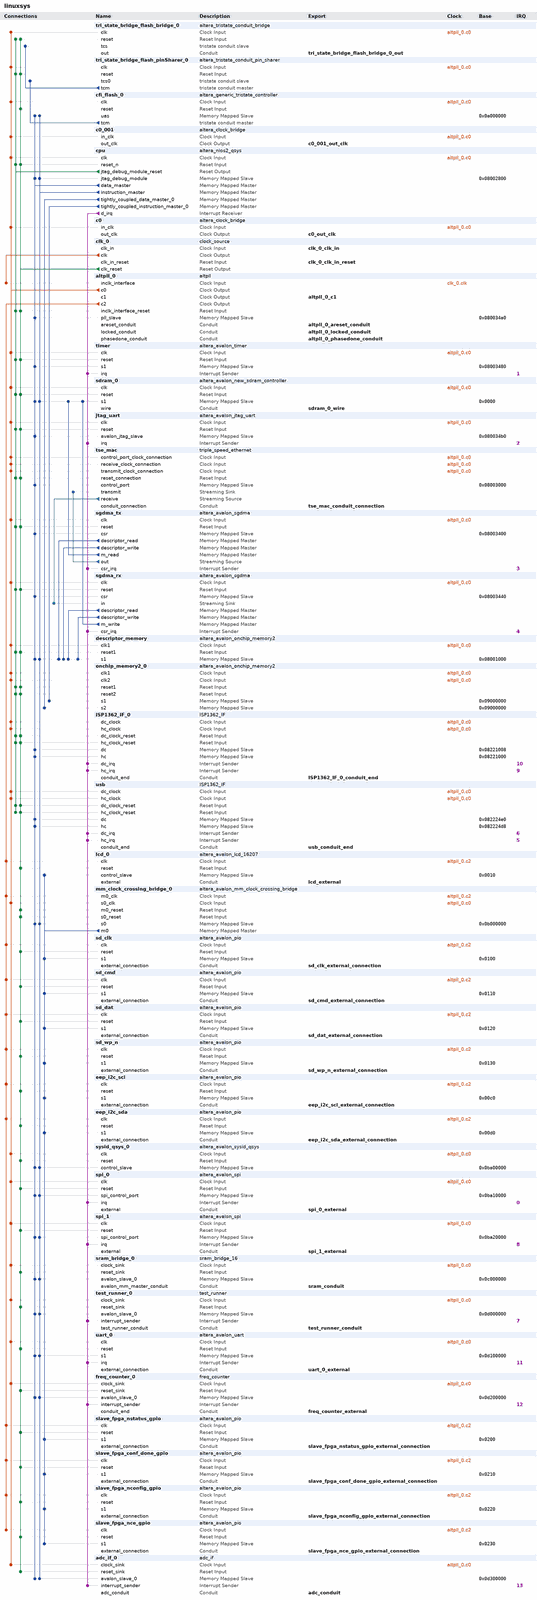
[diagram p0: system contents, whole]
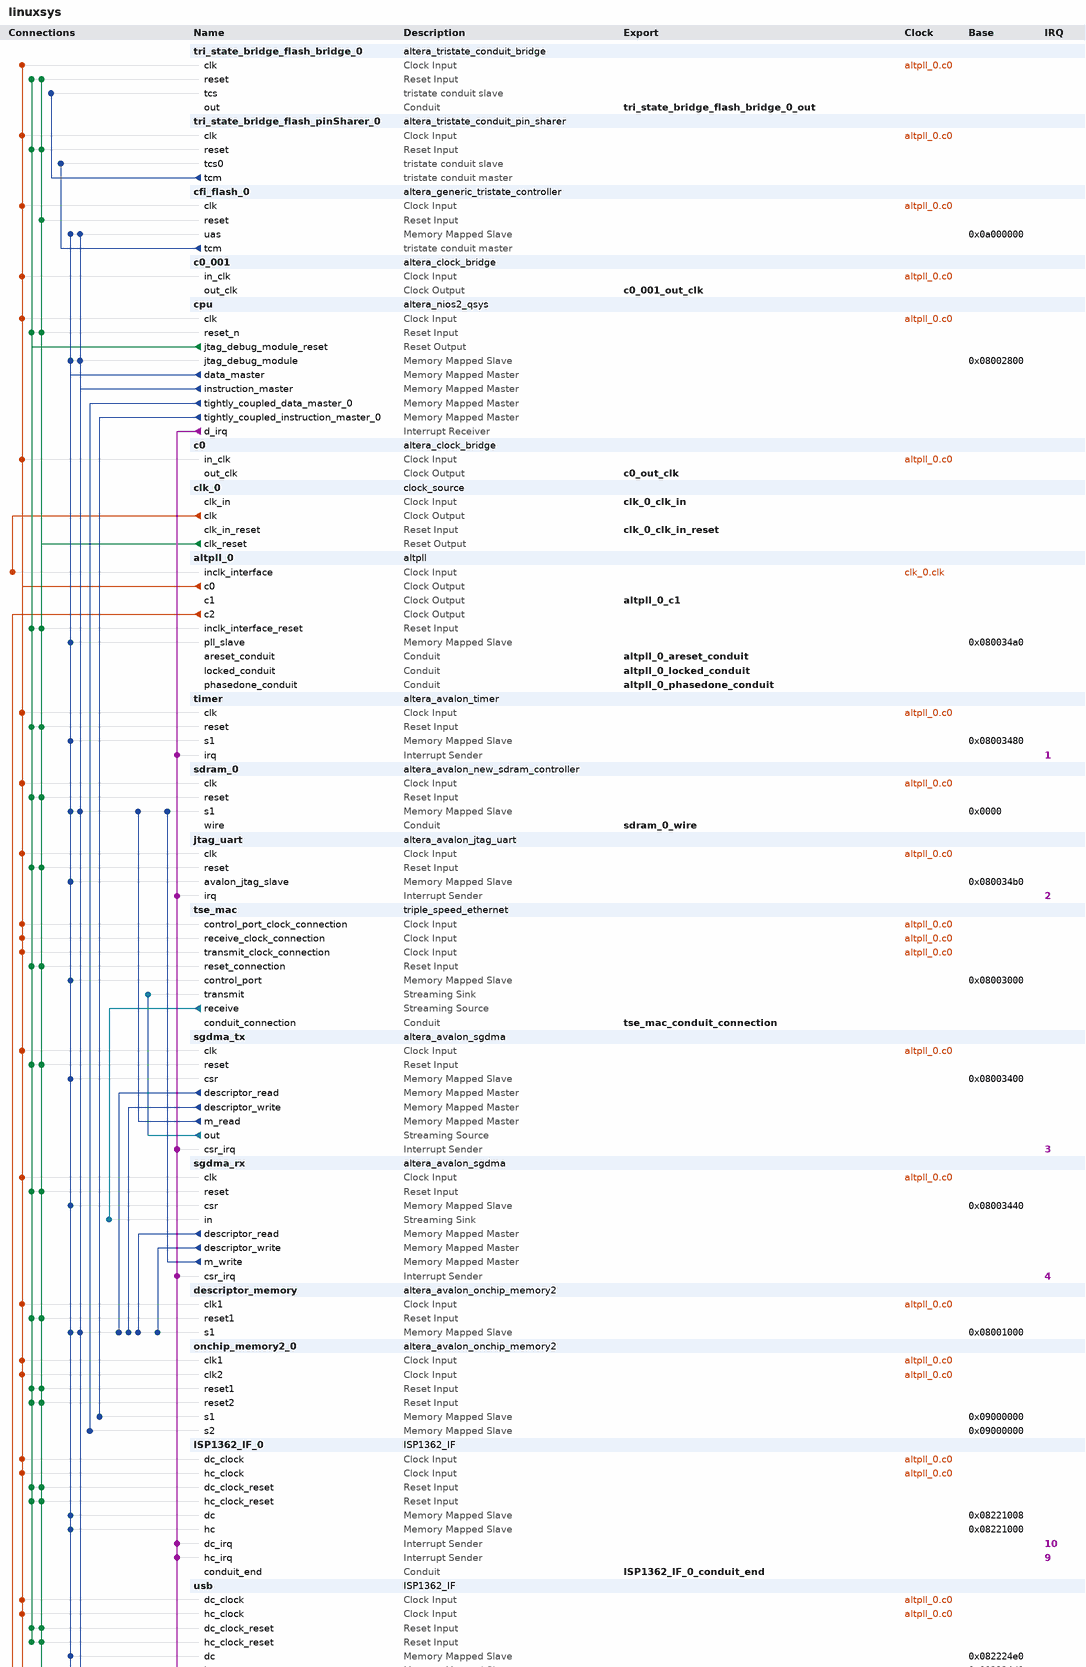
[diagram p1: system contents, upper part]
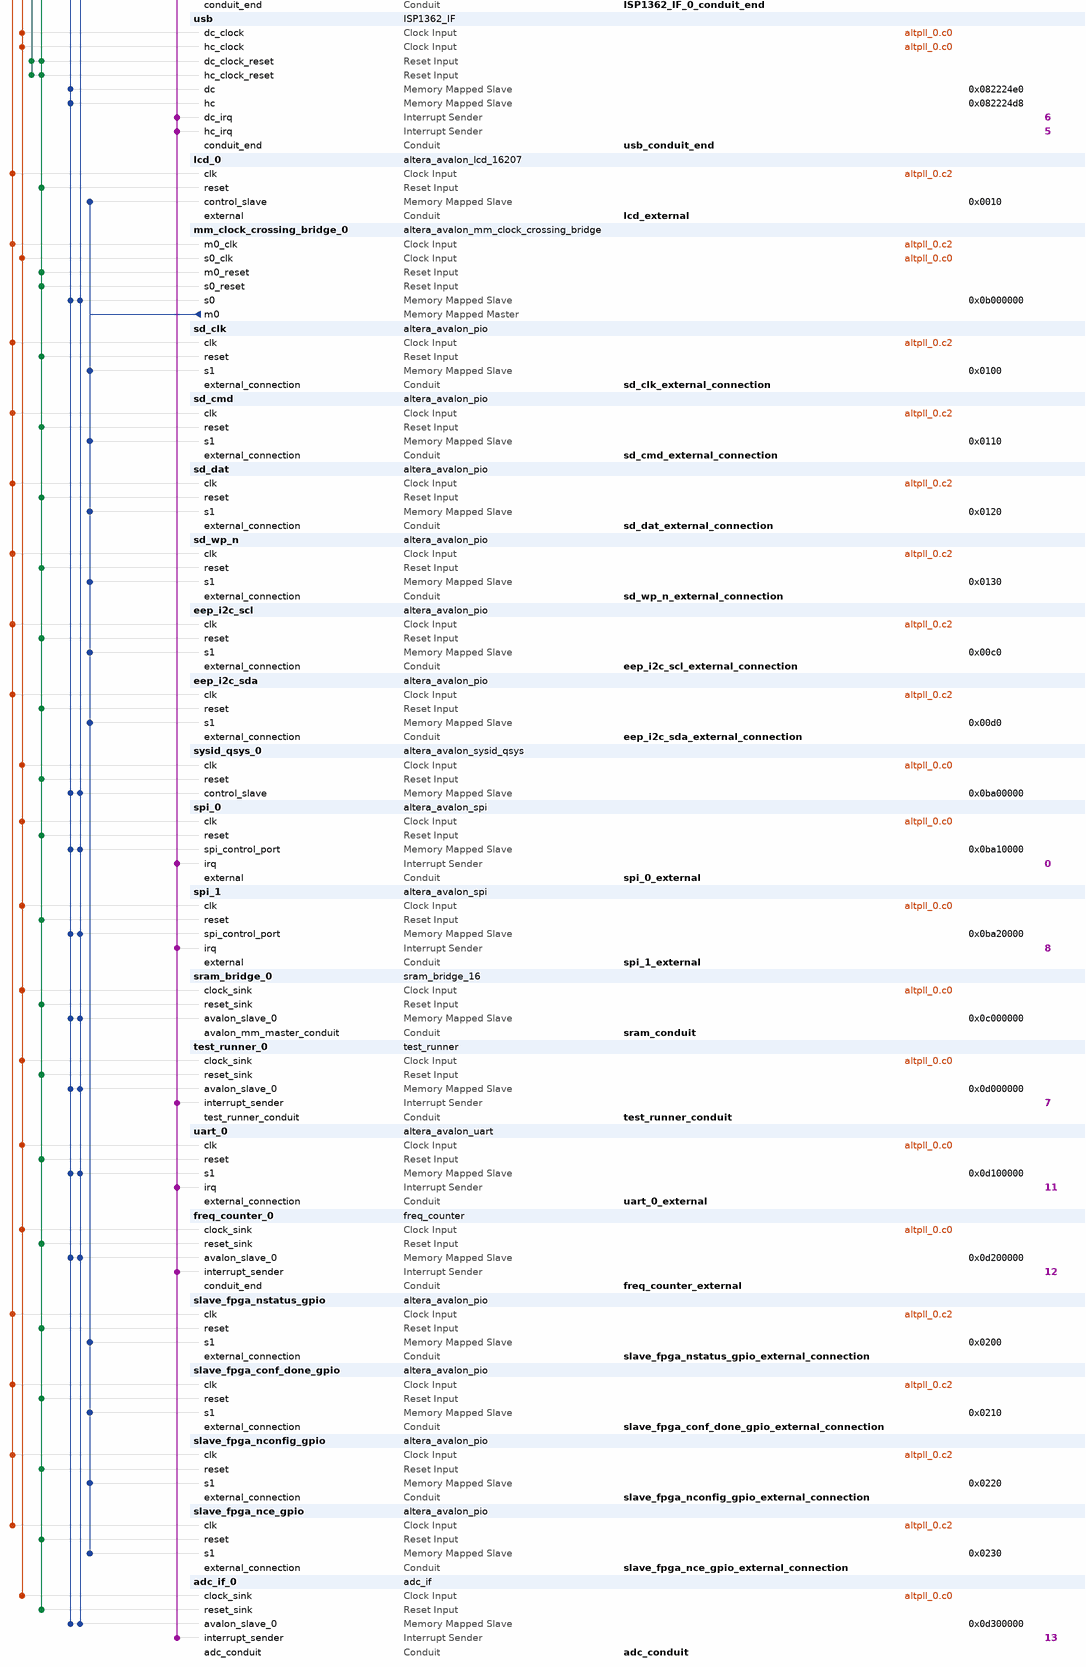
[diagram p2: system contents, lower part]
# Platform Designer (Qsys) system linuxsys, CYCLONEIVE auto
# Parameters at their usual value, and those the tool derives, are not listed.
package require -exact qsys 11.1
create_system linuxsys
set_project_property DEVICE_FAMILY CYCLONEIVE
set_project_property DEVICE auto

add_instance tri_state_bridge_flash_bridge_0 altera_tristate_conduit_bridge 11.1

add_instance tri_state_bridge_flash_pinSharer_0 altera_tristate_conduit_pin_sharer 11.1
set_instance_parameter_value tri_state_bridge_flash_pinSharer_0 NUM_INTERFACES 1
set_instance_parameter_value tri_state_bridge_flash_pinSharer_0 MODULE_ORIGIN_LIST cfi_flash_0.tcm,cfi_flash_0.tcm,cfi_flash_0.tcm,cfi_flash_0.tcm,cfi_flash_0.tcm
set_instance_parameter_value tri_state_bridge_flash_pinSharer_0 SHARED_SIGNAL_LIST address_to_the_cfi_flash_0,read_n_to_the_cfi_flash_0,write_n_to_the_cfi_flash_0,data_to_and_from_the_cfi_flash_0,select_n_to_the_cfi_flash_0

add_instance cfi_flash_0 altera_generic_tristate_controller 11.1
set_instance_parameter_value cfi_flash_0 TCM_ADDRESS_W 23
set_instance_parameter_value cfi_flash_0 TCM_DATA_W 8
set_instance_parameter_value cfi_flash_0 TCM_BYTEENABLE_W 1
set_instance_parameter_value cfi_flash_0 TCM_READ_WAIT 160
set_instance_parameter_value cfi_flash_0 TCM_WRITE_WAIT 160
set_instance_parameter_value cfi_flash_0 TCM_SETUP_WAIT 60
set_instance_parameter_value cfi_flash_0 TCM_DATA_HOLD 60
set_instance_parameter_value cfi_flash_0 TCM_MAX_PENDING_READ_TRANSACTIONS 3
set_instance_parameter_value cfi_flash_0 TCM_TURNAROUND_TIME 2
set_instance_parameter_value cfi_flash_0 TCM_TIMING_UNITS 0
set_instance_parameter_value cfi_flash_0 TCM_READLATENCY 2
set_instance_parameter_value cfi_flash_0 TCM_SYMBOLS_PER_WORD 1
set_instance_parameter_value cfi_flash_0 USE_READ 1
set_instance_parameter_value cfi_flash_0 USE_BEGINTRANSFER 0
set_instance_parameter_value cfi_flash_0 USE_BYTEENABLE 0
set_instance_parameter_value cfi_flash_0 USE_OUTPUTENABLE 0
set_instance_parameter_value cfi_flash_0 ACTIVE_LOW_READ 1
set_instance_parameter_value cfi_flash_0 ACTIVE_LOW_BYTEENABLE 0
set_instance_parameter_value cfi_flash_0 ACTIVE_LOW_OUTPUTENABLE 0
set_instance_parameter_value cfi_flash_0 ACTIVE_LOW_BEGINTRANSFER 0
set_instance_parameter_value cfi_flash_0 CHIPSELECT_THROUGH_READLATENCY 0
set_instance_parameter_value cfi_flash_0 MODULE_ASSIGNMENT_KEYS embeddedsw.configuration.hwClassnameDriverSupportList,embeddedsw.configuration.hwClassnameDriverSupportDefault,embeddedsw.CMacro.SETUP_VALUE,embeddedsw.CMacro.WAIT_VALUE,embeddedsw.CMacro.HOLD_VALUE,embeddedsw.CMacro.TIMING_UNITS,embeddedsw.CMacro.SIZE,embeddedsw.memoryInfo.MEM_INIT_DATA_WIDTH,embeddedsw.memoryInfo.HAS_BYTE_LANE,embeddedsw.memoryInfo.IS_FLASH,embeddedsw.memoryInfo.GENERATE_DAT_SYM,embeddedsw.memoryInfo.GENERATE_FLASH,embeddedsw.memoryInfo.DAT_SYM_INSTALL_DIR,embeddedsw.memoryInfo.FLASH_INSTALL_DIR
set_instance_parameter_value cfi_flash_0 MODULE_ASSIGNMENT_VALUES {altera_avalon_lan91c111:altera_avalon_cfi_flash,altera_avalon_cfi_flash,60,160,60,"ns",8388608u,8,0,1,1,1,SIM_DIR,APP_DIR}
set_instance_parameter_value cfi_flash_0 INTERFACE_ASSIGNMENT_KEYS embeddedsw.configuration.isFlash,embeddedsw.configuration.isMemoryDevice,embeddedsw.configuration.isNonVolatileStorage
set_instance_parameter_value cfi_flash_0 INTERFACE_ASSIGNMENT_VALUES 1,1,1

add_instance c0_001 altera_clock_bridge 11.1
set_instance_parameter_value c0_001 DERIVED_CLOCK_RATE 100000000
set_instance_parameter_value c0_001 EXPLICIT_CLOCK_RATE 0

add_instance cpu altera_nios2_qsys 11.1
set_instance_parameter_value cpu muldiv_divider true
set_instance_parameter_value cpu mmu_enabled true
set_instance_parameter_value cpu resetSlave cfi_flash_0.uas
set_instance_parameter_value cpu mmu_TLBMissExcSlave onchip_memory2_0.s1
set_instance_parameter_value cpu exceptionSlave sdram_0.s1
set_instance_parameter_value cpu breakSlave cpu.jtag_debug_module
set_instance_parameter_value cpu mmu_processIDNumBits 10
set_instance_parameter_value cpu impl Fast
set_instance_parameter_value cpu icache_size 65536
set_instance_parameter_value cpu icache_numTCIM 1
set_instance_parameter_value cpu dcache_size 32768
set_instance_parameter_value cpu dcache_numTCDM 1

add_instance c0 altera_clock_bridge 11.1
set_instance_parameter_value c0 DERIVED_CLOCK_RATE 100000000
set_instance_parameter_value c0 EXPLICIT_CLOCK_RATE 0

add_instance clk_0 clock_source 11.1
set_instance_parameter_value clk_0 clockFrequency 50000000

add_instance altpll_0 altpll 11.1
set_instance_parameter_value altpll_0 INCLK0_INPUT_FREQUENCY 20000
set_instance_parameter_value altpll_0 CLK0_MULTIPLY_BY 2
set_instance_parameter_value altpll_0 CLK1_MULTIPLY_BY 2
set_instance_parameter_value altpll_0 CLK2_MULTIPLY_BY 1
set_instance_parameter_value altpll_0 CLK0_DIVIDE_BY 1
set_instance_parameter_value altpll_0 CLK1_DIVIDE_BY 1
set_instance_parameter_value altpll_0 CLK2_DIVIDE_BY 5
set_instance_parameter_value altpll_0 CLK1_PHASE_SHIFT -1806
set_instance_parameter_value altpll_0 CLK2_PHASE_SHIFT 0
set_instance_parameter_value altpll_0 CLK1_DUTY_CYCLE 50
set_instance_parameter_value altpll_0 CLK2_DUTY_CYCLE 50
set_instance_parameter_value altpll_0 PORT_clk1 PORT_USED
set_instance_parameter_value altpll_0 PORT_clk2 PORT_USED
set_instance_parameter_value altpll_0 PORT_clk3 PORT_UNUSED
set_instance_parameter_value altpll_0 PORT_ARESET PORT_USED
set_instance_parameter_value altpll_0 PORT_LOCKED PORT_UNUSED

add_instance timer altera_avalon_timer 11.1
set_instance_parameter_value timer period 1
set_instance_parameter_value timer periodUnits MSEC
set_instance_parameter_value timer timerPreset CUSTOM

add_instance sdram_0 altera_avalon_new_sdram_controller 11.1
set_instance_parameter_value sdram_0 TAC 5.5
set_instance_parameter_value sdram_0 TRCD 20.0
set_instance_parameter_value sdram_0 TRP 20.0
set_instance_parameter_value sdram_0 casLatency 3
set_instance_parameter_value sdram_0 columnWidth 10
set_instance_parameter_value sdram_0 dataWidth 32
set_instance_parameter_value sdram_0 generateSimulationModel false
set_instance_parameter_value sdram_0 model custom
set_instance_parameter_value sdram_0 numberOfBanks 4
set_instance_parameter_value sdram_0 numberOfChipSelects 1
set_instance_parameter_value sdram_0 powerUpDelay 100.0
set_instance_parameter_value sdram_0 refreshPeriod 15.625
set_instance_parameter_value sdram_0 rowWidth 13

add_instance jtag_uart altera_avalon_jtag_uart 11.1
set_instance_parameter_value jtag_uart simInteractiveOptions INTERACTIVE_ASCII_OUTPUT

add_instance tse_mac triple_speed_ethernet 11.1
set_instance_parameter_value tse_mac atlanticSinkClockRate 0
set_instance_parameter_value tse_mac atlanticSinkClockSource unassigned
set_instance_parameter_value tse_mac atlanticSourceClockRate 0
set_instance_parameter_value tse_mac atlanticSourceClockSource unassigned
set_instance_parameter_value tse_mac avalonSlaveClockRate 0
set_instance_parameter_value tse_mac avalonSlaveClockSource unassigned
set_instance_parameter_value tse_mac avalonStNeighbours {unassigned=unassigned}
set_instance_parameter_value tse_mac channel_count 1
set_instance_parameter_value tse_mac core_variation MAC_ONLY
set_instance_parameter_value tse_mac core_version 2817
set_instance_parameter_value tse_mac crc32check16bit 0
set_instance_parameter_value tse_mac crc32dwidth 8
set_instance_parameter_value tse_mac crc32gendelay 6
set_instance_parameter_value tse_mac crc32s1l2_extern false
set_instance_parameter_value tse_mac cust_version 0
set_instance_parameter_value tse_mac dataBitsPerSymbol 8
set_instance_parameter_value tse_mac dev_version 2817
set_instance_parameter_value tse_mac eg_addr 12
set_instance_parameter_value tse_mac ena_hash false
set_instance_parameter_value tse_mac enable_alt_reconfig false
set_instance_parameter_value tse_mac enable_clk_sharing false
set_instance_parameter_value tse_mac enable_ena 32
set_instance_parameter_value tse_mac enable_fifoless false
set_instance_parameter_value tse_mac enable_gmii_loopback true
set_instance_parameter_value tse_mac enable_hd_logic false
set_instance_parameter_value tse_mac enable_mac_flow_ctrl true
set_instance_parameter_value tse_mac enable_mac_txaddr_set true
set_instance_parameter_value tse_mac enable_mac_vlan false
set_instance_parameter_value tse_mac enable_maclite false
set_instance_parameter_value tse_mac enable_magic_detect false
set_instance_parameter_value tse_mac enable_multi_channel false
set_instance_parameter_value tse_mac enable_pkt_class true
set_instance_parameter_value tse_mac enable_pma false
set_instance_parameter_value tse_mac enable_reg_sharing false
set_instance_parameter_value tse_mac enable_sgmii false
set_instance_parameter_value tse_mac enable_shift16 true
set_instance_parameter_value tse_mac enable_sup_addr false
set_instance_parameter_value tse_mac enable_use_internal_fifo true
set_instance_parameter_value tse_mac export_calblkclk false
set_instance_parameter_value tse_mac export_pwrdn false
set_instance_parameter_value tse_mac ext_stat_cnt_ena false
set_instance_parameter_value tse_mac gigeAdvanceMode true
set_instance_parameter_value tse_mac ifGMII RGMII
set_instance_parameter_value tse_mac ifPCSuseEmbeddedSerdes false
set_instance_parameter_value tse_mac ing_addr 12
set_instance_parameter_value tse_mac insert_ta true
set_instance_parameter_value tse_mac maclite_gige false
set_instance_parameter_value tse_mac max_channels 1
set_instance_parameter_value tse_mac mdio_clk_div 40
set_instance_parameter_value tse_mac phy_identifier 0
set_instance_parameter_value tse_mac ramType AUTO
set_instance_parameter_value tse_mac reset_level 1
set_instance_parameter_value tse_mac starting_channel_number 0
set_instance_parameter_value tse_mac stat_cnt_ena false
set_instance_parameter_value tse_mac timingAdapterName timingAdapter
set_instance_parameter_value tse_mac toolContext SOPC_BUILDER
set_instance_parameter_value tse_mac transceiver_type GXB
set_instance_parameter_value tse_mac uiHostClockFrequency 0
set_instance_parameter_value tse_mac uiMDIOFreq {0.0 MHz}
set_instance_parameter_value tse_mac useLvds false
set_instance_parameter_value tse_mac useMAC true
set_instance_parameter_value tse_mac useMDIO true
set_instance_parameter_value tse_mac usePCS false
set_instance_parameter_value tse_mac use_sync_reset true

add_instance sgdma_tx altera_avalon_sgdma 11.1
set_instance_parameter_value sgdma_tx enableBurstTransfers false
set_instance_parameter_value sgdma_tx enableUnalignedTransfers false
set_instance_parameter_value sgdma_tx readBlockDataWidth 32
set_instance_parameter_value sgdma_tx sinkErrorWidth 0
set_instance_parameter_value sgdma_tx sourceErrorWidth 1
set_instance_parameter_value sgdma_tx transferMode MEMORY_TO_STREAM
set_instance_parameter_value sgdma_tx writeBurstcountWidth 4

add_instance sgdma_rx altera_avalon_sgdma 11.1
set_instance_parameter_value sgdma_rx enableBurstTransfers false
set_instance_parameter_value sgdma_rx enableUnalignedTransfers false
set_instance_parameter_value sgdma_rx readBlockDataWidth 32
set_instance_parameter_value sgdma_rx sinkErrorWidth 6
set_instance_parameter_value sgdma_rx sourceErrorWidth 0
set_instance_parameter_value sgdma_rx transferMode STREAM_TO_MEMORY
set_instance_parameter_value sgdma_rx writeBurstcountWidth 4

add_instance descriptor_memory altera_avalon_onchip_memory2 11.1
set_instance_parameter_value descriptor_memory dataWidth 32
set_instance_parameter_value descriptor_memory dualPort false
set_instance_parameter_value descriptor_memory initMemContent true
set_instance_parameter_value descriptor_memory initializationFileName descriptor_memory
set_instance_parameter_value descriptor_memory memorySize 4096

add_instance onchip_memory2_0 altera_avalon_onchip_memory2 11.1
set_instance_parameter_value onchip_memory2_0 dataWidth 32
set_instance_parameter_value onchip_memory2_0 dualPort true
set_instance_parameter_value onchip_memory2_0 initMemContent true
set_instance_parameter_value onchip_memory2_0 initializationFileName onchip_memory2_0
set_instance_parameter_value onchip_memory2_0 memorySize 512

add_instance ISP1362_IF_0 ISP1362_IF 1.0

add_instance usb ISP1362_IF 1.0

add_instance lcd_0 altera_avalon_lcd_16207 11.1

add_instance mm_clock_crossing_bridge_0 altera_avalon_mm_clock_crossing_bridge 11.1
set_instance_parameter_value mm_clock_crossing_bridge_0 DATA_WIDTH 32
set_instance_parameter_value mm_clock_crossing_bridge_0 ADDRESS_WIDTH 10
set_instance_parameter_value mm_clock_crossing_bridge_0 MAX_BURST_SIZE 1
set_instance_parameter_value mm_clock_crossing_bridge_0 COMMAND_FIFO_DEPTH 32
set_instance_parameter_value mm_clock_crossing_bridge_0 RESPONSE_FIFO_DEPTH 256
set_instance_parameter_value mm_clock_crossing_bridge_0 MASTER_SYNC_DEPTH 3
set_instance_parameter_value mm_clock_crossing_bridge_0 SLAVE_SYNC_DEPTH 3

add_instance sd_clk altera_avalon_pio 11.1
set_instance_parameter_value sd_clk direction Output
set_instance_parameter_value sd_clk width 1

add_instance sd_cmd altera_avalon_pio 11.1
set_instance_parameter_value sd_cmd direction Bidir
set_instance_parameter_value sd_cmd width 1

add_instance sd_dat altera_avalon_pio 11.1
set_instance_parameter_value sd_dat direction Bidir
set_instance_parameter_value sd_dat width 4

add_instance sd_wp_n altera_avalon_pio 11.1
set_instance_parameter_value sd_wp_n direction Input
set_instance_parameter_value sd_wp_n width 1

add_instance eep_i2c_scl altera_avalon_pio 11.1
set_instance_parameter_value eep_i2c_scl direction Output
set_instance_parameter_value eep_i2c_scl width 1

add_instance eep_i2c_sda altera_avalon_pio 11.1
set_instance_parameter_value eep_i2c_sda direction Bidir
set_instance_parameter_value eep_i2c_sda width 1

add_instance sysid_qsys_0 altera_avalon_sysid_qsys 11.1
set_instance_parameter_value sysid_qsys_0 id -1412567296

add_instance spi_0 altera_avalon_spi 11.1
set_instance_parameter_value spi_0 clockPolarity 0
set_instance_parameter_value spi_0 dataWidth 8
set_instance_parameter_value spi_0 masterSPI true
set_instance_parameter_value spi_0 numberOfSlaves 1
set_instance_parameter_value spi_0 targetClockRate 10000000

add_instance spi_1 altera_avalon_spi 11.1
set_instance_parameter_value spi_1 clockPolarity 0
set_instance_parameter_value spi_1 dataWidth 8
set_instance_parameter_value spi_1 masterSPI true
set_instance_parameter_value spi_1 numberOfSlaves 1
set_instance_parameter_value spi_1 targetClockRate 10000000

add_instance sram_bridge_0 sram_bridge_16 1.0
set_instance_parameter_value sram_bridge_0 ADDR_WIDTH 20

add_instance test_runner_0 test_runner 1.0
set_instance_parameter_value test_runner_0 ADDR_WIDTH 8
set_instance_parameter_value test_runner_0 DATA_WIDTH 8
set_instance_parameter_value test_runner_0 NREGS 128

add_instance uart_0 altera_avalon_uart 11.1
set_instance_parameter_value uart_0 baud 115200
set_instance_parameter_value uart_0 dataBits 8
set_instance_parameter_value uart_0 fixedBaud true
set_instance_parameter_value uart_0 parity NONE
set_instance_parameter_value uart_0 stopBits 1
set_instance_parameter_value uart_0 useCtsRts true

add_instance freq_counter_0 freq_counter 1.0
set_instance_parameter_value freq_counter_0 ADDR_WIDTH 8
set_instance_parameter_value freq_counter_0 DATA_WIDTH 32
set_instance_parameter_value freq_counter_0 NREGS 5
set_instance_parameter_value freq_counter_0 NDESIGNS 24

add_instance slave_fpga_nstatus_gpio altera_avalon_pio 11.1
set_instance_parameter_value slave_fpga_nstatus_gpio direction Input
set_instance_parameter_value slave_fpga_nstatus_gpio width 1

add_instance slave_fpga_conf_done_gpio altera_avalon_pio 11.1
set_instance_parameter_value slave_fpga_conf_done_gpio direction Input
set_instance_parameter_value slave_fpga_conf_done_gpio width 1

add_instance slave_fpga_nconfig_gpio altera_avalon_pio 11.1
set_instance_parameter_value slave_fpga_nconfig_gpio direction Output
set_instance_parameter_value slave_fpga_nconfig_gpio width 1

add_instance slave_fpga_nce_gpio altera_avalon_pio 11.1
set_instance_parameter_value slave_fpga_nce_gpio direction Output
set_instance_parameter_value slave_fpga_nce_gpio width 1

add_instance adc_if_0 adc_if 1.0
set_instance_parameter_value adc_if_0 ADDR_WIDTH 8
set_instance_parameter_value adc_if_0 DATA_WIDTH 8
set_instance_parameter_value adc_if_0 NREGS 16

# connections
add_connection altpll_0.c0 adc_if_0.clock_sink clock
add_connection altpll_0.c0 c0.in_clk clock
add_connection altpll_0.c0 c0_001.in_clk clock
add_connection altpll_0.c0 cfi_flash_0.clk clock
add_connection altpll_0.c0 cpu.clk clock
add_connection altpll_0.c0 descriptor_memory.clk1 clock
add_connection altpll_0.c0 freq_counter_0.clock_sink clock
add_connection altpll_0.c0 ISP1362_IF_0.dc_clock clock
add_connection altpll_0.c0 ISP1362_IF_0.hc_clock clock
add_connection altpll_0.c0 jtag_uart.clk clock
add_connection altpll_0.c0 mm_clock_crossing_bridge_0.s0_clk clock
add_connection altpll_0.c0 onchip_memory2_0.clk1 clock
add_connection altpll_0.c0 onchip_memory2_0.clk2 clock
add_connection altpll_0.c0 sdram_0.clk clock
add_connection altpll_0.c0 sgdma_rx.clk clock
add_connection altpll_0.c0 sgdma_tx.clk clock
add_connection altpll_0.c0 spi_0.clk clock
add_connection altpll_0.c0 spi_1.clk clock
add_connection altpll_0.c0 sram_bridge_0.clock_sink clock
add_connection altpll_0.c0 sysid_qsys_0.clk clock
add_connection altpll_0.c0 test_runner_0.clock_sink clock
add_connection altpll_0.c0 timer.clk clock
add_connection altpll_0.c0 tri_state_bridge_flash_bridge_0.clk clock
add_connection altpll_0.c0 tri_state_bridge_flash_pinSharer_0.clk clock
add_connection altpll_0.c0 tse_mac.control_port_clock_connection clock
add_connection altpll_0.c0 tse_mac.receive_clock_connection clock
add_connection altpll_0.c0 tse_mac.transmit_clock_connection clock
add_connection altpll_0.c0 uart_0.clk clock
add_connection altpll_0.c0 usb.dc_clock clock
add_connection altpll_0.c0 usb.hc_clock clock
add_connection altpll_0.c2 eep_i2c_scl.clk clock
add_connection altpll_0.c2 eep_i2c_sda.clk clock
add_connection altpll_0.c2 lcd_0.clk clock
add_connection altpll_0.c2 mm_clock_crossing_bridge_0.m0_clk clock
add_connection altpll_0.c2 sd_clk.clk clock
add_connection altpll_0.c2 sd_cmd.clk clock
add_connection altpll_0.c2 sd_dat.clk clock
add_connection altpll_0.c2 sd_wp_n.clk clock
add_connection altpll_0.c2 slave_fpga_conf_done_gpio.clk clock
add_connection altpll_0.c2 slave_fpga_nce_gpio.clk clock
add_connection altpll_0.c2 slave_fpga_nconfig_gpio.clk clock
add_connection altpll_0.c2 slave_fpga_nstatus_gpio.clk clock
add_connection clk_0.clk altpll_0.inclk_interface clock
add_connection clk_0.clk_reset adc_if_0.reset_sink reset
add_connection clk_0.clk_reset altpll_0.inclk_interface_reset reset
add_connection clk_0.clk_reset cfi_flash_0.reset reset
add_connection clk_0.clk_reset cpu.reset_n reset
add_connection clk_0.clk_reset descriptor_memory.reset1 reset
add_connection clk_0.clk_reset eep_i2c_scl.reset reset
add_connection clk_0.clk_reset eep_i2c_sda.reset reset
add_connection clk_0.clk_reset freq_counter_0.reset_sink reset
add_connection clk_0.clk_reset ISP1362_IF_0.dc_clock_reset reset
add_connection clk_0.clk_reset ISP1362_IF_0.hc_clock_reset reset
add_connection clk_0.clk_reset jtag_uart.reset reset
add_connection clk_0.clk_reset lcd_0.reset reset
add_connection clk_0.clk_reset mm_clock_crossing_bridge_0.m0_reset reset
add_connection clk_0.clk_reset mm_clock_crossing_bridge_0.s0_reset reset
add_connection clk_0.clk_reset onchip_memory2_0.reset1 reset
add_connection clk_0.clk_reset onchip_memory2_0.reset2 reset
add_connection clk_0.clk_reset sd_clk.reset reset
add_connection clk_0.clk_reset sd_cmd.reset reset
add_connection clk_0.clk_reset sd_dat.reset reset
add_connection clk_0.clk_reset sd_wp_n.reset reset
add_connection clk_0.clk_reset sdram_0.reset reset
add_connection clk_0.clk_reset sgdma_rx.reset reset
add_connection clk_0.clk_reset sgdma_tx.reset reset
add_connection clk_0.clk_reset slave_fpga_conf_done_gpio.reset reset
add_connection clk_0.clk_reset slave_fpga_nce_gpio.reset reset
add_connection clk_0.clk_reset slave_fpga_nconfig_gpio.reset reset
add_connection clk_0.clk_reset slave_fpga_nstatus_gpio.reset reset
add_connection clk_0.clk_reset spi_0.reset reset
add_connection clk_0.clk_reset spi_1.reset reset
add_connection clk_0.clk_reset sram_bridge_0.reset_sink reset
add_connection clk_0.clk_reset sysid_qsys_0.reset reset
add_connection clk_0.clk_reset test_runner_0.reset_sink reset
add_connection clk_0.clk_reset timer.reset reset
add_connection clk_0.clk_reset tri_state_bridge_flash_bridge_0.reset reset
add_connection clk_0.clk_reset tri_state_bridge_flash_pinSharer_0.reset reset
add_connection clk_0.clk_reset tse_mac.reset_connection reset
add_connection clk_0.clk_reset uart_0.reset reset
add_connection clk_0.clk_reset usb.dc_clock_reset reset
add_connection clk_0.clk_reset usb.hc_clock_reset reset
add_connection cpu.jtag_debug_module_reset altpll_0.inclk_interface_reset reset
add_connection cpu.jtag_debug_module_reset cpu.reset_n reset
add_connection cpu.jtag_debug_module_reset descriptor_memory.reset1 reset
add_connection cpu.jtag_debug_module_reset ISP1362_IF_0.dc_clock_reset reset
add_connection cpu.jtag_debug_module_reset ISP1362_IF_0.hc_clock_reset reset
add_connection cpu.jtag_debug_module_reset jtag_uart.reset reset
add_connection cpu.jtag_debug_module_reset onchip_memory2_0.reset1 reset
add_connection cpu.jtag_debug_module_reset onchip_memory2_0.reset2 reset
add_connection cpu.jtag_debug_module_reset sdram_0.reset reset
add_connection cpu.jtag_debug_module_reset sgdma_rx.reset reset
add_connection cpu.jtag_debug_module_reset sgdma_tx.reset reset
add_connection cpu.jtag_debug_module_reset timer.reset reset
add_connection cpu.jtag_debug_module_reset tri_state_bridge_flash_bridge_0.reset reset
add_connection cpu.jtag_debug_module_reset tri_state_bridge_flash_pinSharer_0.reset reset
add_connection cpu.jtag_debug_module_reset tse_mac.reset_connection reset
add_connection cpu.jtag_debug_module_reset usb.dc_clock_reset reset
add_connection cpu.jtag_debug_module_reset usb.hc_clock_reset reset
add_connection cpu.data_master adc_if_0.avalon_slave_0 avalon
set_connection_parameter_value cpu.data_master/adc_if_0.avalon_slave_0 baseAddress 0x0d300000
add_connection cpu.data_master altpll_0.pll_slave avalon
set_connection_parameter_value cpu.data_master/altpll_0.pll_slave baseAddress 0x080034a0
add_connection cpu.data_master cfi_flash_0.uas avalon
set_connection_parameter_value cpu.data_master/cfi_flash_0.uas baseAddress 0x0a000000
add_connection cpu.data_master cpu.jtag_debug_module avalon
set_connection_parameter_value cpu.data_master/cpu.jtag_debug_module baseAddress 0x08002800
add_connection cpu.data_master descriptor_memory.s1 avalon
set_connection_parameter_value cpu.data_master/descriptor_memory.s1 baseAddress 0x08001000
add_connection cpu.data_master freq_counter_0.avalon_slave_0 avalon
set_connection_parameter_value cpu.data_master/freq_counter_0.avalon_slave_0 baseAddress 0x0d200000
add_connection cpu.data_master ISP1362_IF_0.dc avalon
set_connection_parameter_value cpu.data_master/ISP1362_IF_0.dc baseAddress 0x08221008
add_connection cpu.data_master ISP1362_IF_0.hc avalon
set_connection_parameter_value cpu.data_master/ISP1362_IF_0.hc baseAddress 0x08221000
add_connection cpu.data_master jtag_uart.avalon_jtag_slave avalon
set_connection_parameter_value cpu.data_master/jtag_uart.avalon_jtag_slave baseAddress 0x080034b0
add_connection cpu.data_master mm_clock_crossing_bridge_0.s0 avalon
set_connection_parameter_value cpu.data_master/mm_clock_crossing_bridge_0.s0 baseAddress 0x0b000000
add_connection cpu.data_master sdram_0.s1 avalon
set_connection_parameter_value cpu.data_master/sdram_0.s1 baseAddress 0x0000
add_connection cpu.data_master sgdma_rx.csr avalon
set_connection_parameter_value cpu.data_master/sgdma_rx.csr baseAddress 0x08003440
add_connection cpu.data_master sgdma_tx.csr avalon
set_connection_parameter_value cpu.data_master/sgdma_tx.csr baseAddress 0x08003400
add_connection cpu.data_master spi_0.spi_control_port avalon
set_connection_parameter_value cpu.data_master/spi_0.spi_control_port baseAddress 0x0ba10000
add_connection cpu.data_master spi_1.spi_control_port avalon
set_connection_parameter_value cpu.data_master/spi_1.spi_control_port baseAddress 0x0ba20000
add_connection cpu.data_master sram_bridge_0.avalon_slave_0 avalon
set_connection_parameter_value cpu.data_master/sram_bridge_0.avalon_slave_0 baseAddress 0x0c000000
add_connection cpu.data_master sysid_qsys_0.control_slave avalon
set_connection_parameter_value cpu.data_master/sysid_qsys_0.control_slave baseAddress 0x0ba00000
add_connection cpu.data_master test_runner_0.avalon_slave_0 avalon
set_connection_parameter_value cpu.data_master/test_runner_0.avalon_slave_0 baseAddress 0x0d000000
add_connection cpu.data_master timer.s1 avalon
set_connection_parameter_value cpu.data_master/timer.s1 baseAddress 0x08003480
add_connection cpu.data_master tse_mac.control_port avalon
set_connection_parameter_value cpu.data_master/tse_mac.control_port baseAddress 0x08003000
add_connection cpu.data_master uart_0.s1 avalon
set_connection_parameter_value cpu.data_master/uart_0.s1 baseAddress 0x0d100000
add_connection cpu.data_master usb.dc avalon
set_connection_parameter_value cpu.data_master/usb.dc baseAddress 0x082224e0
add_connection cpu.data_master usb.hc avalon
set_connection_parameter_value cpu.data_master/usb.hc baseAddress 0x082224d8
add_connection cpu.instruction_master adc_if_0.avalon_slave_0 avalon
set_connection_parameter_value cpu.instruction_master/adc_if_0.avalon_slave_0 baseAddress 0x0d300000
add_connection cpu.instruction_master cfi_flash_0.uas avalon
set_connection_parameter_value cpu.instruction_master/cfi_flash_0.uas baseAddress 0x0a000000
add_connection cpu.instruction_master cpu.jtag_debug_module avalon
set_connection_parameter_value cpu.instruction_master/cpu.jtag_debug_module baseAddress 0x08002800
add_connection cpu.instruction_master descriptor_memory.s1 avalon
set_connection_parameter_value cpu.instruction_master/descriptor_memory.s1 baseAddress 0x08001000
add_connection cpu.instruction_master freq_counter_0.avalon_slave_0 avalon
set_connection_parameter_value cpu.instruction_master/freq_counter_0.avalon_slave_0 baseAddress 0x0d200000
add_connection cpu.instruction_master mm_clock_crossing_bridge_0.s0 avalon
set_connection_parameter_value cpu.instruction_master/mm_clock_crossing_bridge_0.s0 baseAddress 0x0b000000
add_connection cpu.instruction_master sdram_0.s1 avalon
set_connection_parameter_value cpu.instruction_master/sdram_0.s1 baseAddress 0x0000
add_connection cpu.instruction_master spi_0.spi_control_port avalon
set_connection_parameter_value cpu.instruction_master/spi_0.spi_control_port baseAddress 0x0ba10000
add_connection cpu.instruction_master spi_1.spi_control_port avalon
set_connection_parameter_value cpu.instruction_master/spi_1.spi_control_port baseAddress 0x0ba20000
add_connection cpu.instruction_master sram_bridge_0.avalon_slave_0 avalon
set_connection_parameter_value cpu.instruction_master/sram_bridge_0.avalon_slave_0 baseAddress 0x0c000000
add_connection cpu.instruction_master sysid_qsys_0.control_slave avalon
set_connection_parameter_value cpu.instruction_master/sysid_qsys_0.control_slave baseAddress 0x0ba00000
add_connection cpu.instruction_master test_runner_0.avalon_slave_0 avalon
set_connection_parameter_value cpu.instruction_master/test_runner_0.avalon_slave_0 baseAddress 0x0d000000
add_connection cpu.instruction_master uart_0.s1 avalon
set_connection_parameter_value cpu.instruction_master/uart_0.s1 baseAddress 0x0d100000
add_connection cpu.tightly_coupled_data_master_0 onchip_memory2_0.s2 avalon
set_connection_parameter_value cpu.tightly_coupled_data_master_0/onchip_memory2_0.s2 baseAddress 0x09000000
add_connection cpu.tightly_coupled_instruction_master_0 onchip_memory2_0.s1 avalon
set_connection_parameter_value cpu.tightly_coupled_instruction_master_0/onchip_memory2_0.s1 baseAddress 0x09000000
add_connection mm_clock_crossing_bridge_0.m0 eep_i2c_scl.s1 avalon
set_connection_parameter_value mm_clock_crossing_bridge_0.m0/eep_i2c_scl.s1 baseAddress 0x00c0
add_connection mm_clock_crossing_bridge_0.m0 eep_i2c_sda.s1 avalon
set_connection_parameter_value mm_clock_crossing_bridge_0.m0/eep_i2c_sda.s1 baseAddress 0x00d0
add_connection mm_clock_crossing_bridge_0.m0 lcd_0.control_slave avalon
set_connection_parameter_value mm_clock_crossing_bridge_0.m0/lcd_0.control_slave baseAddress 0x0010
add_connection mm_clock_crossing_bridge_0.m0 sd_clk.s1 avalon
set_connection_parameter_value mm_clock_crossing_bridge_0.m0/sd_clk.s1 baseAddress 0x0100
add_connection mm_clock_crossing_bridge_0.m0 sd_cmd.s1 avalon
set_connection_parameter_value mm_clock_crossing_bridge_0.m0/sd_cmd.s1 baseAddress 0x0110
add_connection mm_clock_crossing_bridge_0.m0 sd_dat.s1 avalon
set_connection_parameter_value mm_clock_crossing_bridge_0.m0/sd_dat.s1 baseAddress 0x0120
add_connection mm_clock_crossing_bridge_0.m0 sd_wp_n.s1 avalon
set_connection_parameter_value mm_clock_crossing_bridge_0.m0/sd_wp_n.s1 baseAddress 0x0130
add_connection mm_clock_crossing_bridge_0.m0 slave_fpga_conf_done_gpio.s1 avalon
set_connection_parameter_value mm_clock_crossing_bridge_0.m0/slave_fpga_conf_done_gpio.s1 baseAddress 0x0210
add_connection mm_clock_crossing_bridge_0.m0 slave_fpga_nce_gpio.s1 avalon
set_connection_parameter_value mm_clock_crossing_bridge_0.m0/slave_fpga_nce_gpio.s1 baseAddress 0x0230
add_connection mm_clock_crossing_bridge_0.m0 slave_fpga_nconfig_gpio.s1 avalon
set_connection_parameter_value mm_clock_crossing_bridge_0.m0/slave_fpga_nconfig_gpio.s1 baseAddress 0x0220
add_connection mm_clock_crossing_bridge_0.m0 slave_fpga_nstatus_gpio.s1 avalon
set_connection_parameter_value mm_clock_crossing_bridge_0.m0/slave_fpga_nstatus_gpio.s1 baseAddress 0x0200
add_connection sgdma_rx.descriptor_read descriptor_memory.s1 avalon
set_connection_parameter_value sgdma_rx.descriptor_read/descriptor_memory.s1 baseAddress 0x08001000
add_connection sgdma_rx.descriptor_write descriptor_memory.s1 avalon
set_connection_parameter_value sgdma_rx.descriptor_write/descriptor_memory.s1 baseAddress 0x08001000
add_connection sgdma_rx.m_write sdram_0.s1 avalon
set_connection_parameter_value sgdma_rx.m_write/sdram_0.s1 baseAddress 0x0000
add_connection sgdma_tx.descriptor_read descriptor_memory.s1 avalon
set_connection_parameter_value sgdma_tx.descriptor_read/descriptor_memory.s1 baseAddress 0x08001000
add_connection sgdma_tx.descriptor_write descriptor_memory.s1 avalon
set_connection_parameter_value sgdma_tx.descriptor_write/descriptor_memory.s1 baseAddress 0x08001000
add_connection sgdma_tx.m_read sdram_0.s1 avalon
set_connection_parameter_value sgdma_tx.m_read/sdram_0.s1 baseAddress 0x0000
add_connection sgdma_tx.out tse_mac.transmit avalon_streaming
add_connection tse_mac.receive sgdma_rx.in avalon_streaming
add_connection cpu.d_irq adc_if_0.interrupt_sender interrupt
set_connection_parameter_value cpu.d_irq/adc_if_0.interrupt_sender irqNumber 13
add_connection cpu.d_irq freq_counter_0.interrupt_sender interrupt
set_connection_parameter_value cpu.d_irq/freq_counter_0.interrupt_sender irqNumber 12
add_connection cpu.d_irq ISP1362_IF_0.dc_irq interrupt
set_connection_parameter_value cpu.d_irq/ISP1362_IF_0.dc_irq irqNumber 10
add_connection cpu.d_irq ISP1362_IF_0.hc_irq interrupt
set_connection_parameter_value cpu.d_irq/ISP1362_IF_0.hc_irq irqNumber 9
add_connection cpu.d_irq jtag_uart.irq interrupt
set_connection_parameter_value cpu.d_irq/jtag_uart.irq irqNumber 2
add_connection cpu.d_irq sgdma_rx.csr_irq interrupt
set_connection_parameter_value cpu.d_irq/sgdma_rx.csr_irq irqNumber 4
add_connection cpu.d_irq sgdma_tx.csr_irq interrupt
set_connection_parameter_value cpu.d_irq/sgdma_tx.csr_irq irqNumber 3
add_connection cpu.d_irq spi_0.irq interrupt
set_connection_parameter_value cpu.d_irq/spi_0.irq irqNumber 0
add_connection cpu.d_irq spi_1.irq interrupt
set_connection_parameter_value cpu.d_irq/spi_1.irq irqNumber 8
add_connection cpu.d_irq test_runner_0.interrupt_sender interrupt
set_connection_parameter_value cpu.d_irq/test_runner_0.interrupt_sender irqNumber 7
add_connection cpu.d_irq timer.irq interrupt
set_connection_parameter_value cpu.d_irq/timer.irq irqNumber 1
add_connection cpu.d_irq uart_0.irq interrupt
set_connection_parameter_value cpu.d_irq/uart_0.irq irqNumber 11
add_connection cpu.d_irq usb.dc_irq interrupt
set_connection_parameter_value cpu.d_irq/usb.dc_irq irqNumber 6
add_connection cpu.d_irq usb.hc_irq interrupt
set_connection_parameter_value cpu.d_irq/usb.hc_irq irqNumber 5
add_connection cfi_flash_0.tcm tri_state_bridge_flash_pinSharer_0.tcs0 tristate_conduit
add_connection tri_state_bridge_flash_pinSharer_0.tcm tri_state_bridge_flash_bridge_0.tcs tristate_conduit

# exported interfaces
add_interface altpll_0_c1 clock source
set_interface_property altpll_0_c1 EXPORT_OF altpll_0.c1
add_interface altpll_0_phasedone_conduit conduit end
set_interface_property altpll_0_phasedone_conduit EXPORT_OF altpll_0.phasedone_conduit
add_interface clk_0_clk_in_reset reset sink
set_interface_property clk_0_clk_in_reset EXPORT_OF clk_0.clk_in_reset
add_interface sdram_0_wire conduit end
set_interface_property sdram_0_wire EXPORT_OF sdram_0.wire
add_interface tri_state_bridge_flash_bridge_0_out conduit end
set_interface_property tri_state_bridge_flash_bridge_0_out EXPORT_OF tri_state_bridge_flash_bridge_0.out
add_interface c0_out_clk clock source
set_interface_property c0_out_clk EXPORT_OF c0.out_clk
add_interface altpll_0_areset_conduit conduit end
set_interface_property altpll_0_areset_conduit EXPORT_OF altpll_0.areset_conduit
add_interface altpll_0_locked_conduit conduit end
set_interface_property altpll_0_locked_conduit EXPORT_OF altpll_0.locked_conduit
add_interface clk_0_clk_in clock sink
set_interface_property clk_0_clk_in EXPORT_OF clk_0.clk_in
add_interface usb_conduit_end conduit end
set_interface_property usb_conduit_end EXPORT_OF usb.conduit_end
add_interface ISP1362_IF_0_conduit_end conduit end
set_interface_property ISP1362_IF_0_conduit_end EXPORT_OF ISP1362_IF_0.conduit_end
add_interface c0_001_out_clk clock source
set_interface_property c0_001_out_clk EXPORT_OF c0_001.out_clk
add_interface tse_mac_conduit_connection conduit end
set_interface_property tse_mac_conduit_connection EXPORT_OF tse_mac.conduit_connection
add_interface lcd_external conduit end
set_interface_property lcd_external EXPORT_OF lcd_0.external
add_interface sd_clk_external_connection conduit end
set_interface_property sd_clk_external_connection EXPORT_OF sd_clk.external_connection
add_interface sd_cmd_external_connection conduit end
set_interface_property sd_cmd_external_connection EXPORT_OF sd_cmd.external_connection
add_interface sd_dat_external_connection conduit end
set_interface_property sd_dat_external_connection EXPORT_OF sd_dat.external_connection
add_interface sd_wp_n_external_connection conduit end
set_interface_property sd_wp_n_external_connection EXPORT_OF sd_wp_n.external_connection
add_interface eep_i2c_scl_external_connection conduit end
set_interface_property eep_i2c_scl_external_connection EXPORT_OF eep_i2c_scl.external_connection
add_interface eep_i2c_sda_external_connection conduit end
set_interface_property eep_i2c_sda_external_connection EXPORT_OF eep_i2c_sda.external_connection
add_interface spi_0_external conduit end
set_interface_property spi_0_external EXPORT_OF spi_0.external
add_interface sram_conduit conduit end
set_interface_property sram_conduit EXPORT_OF sram_bridge_0.avalon_mm_master_conduit
add_interface test_runner_conduit conduit end
set_interface_property test_runner_conduit EXPORT_OF test_runner_0.test_runner_conduit
add_interface spi_1_external conduit end
set_interface_property spi_1_external EXPORT_OF spi_1.external
add_interface uart_0_external conduit end
set_interface_property uart_0_external EXPORT_OF uart_0.external_connection
add_interface freq_counter_external conduit end
set_interface_property freq_counter_external EXPORT_OF freq_counter_0.conduit_end
add_interface slave_fpga_nstatus_gpio_external_connection conduit end
set_interface_property slave_fpga_nstatus_gpio_external_connection EXPORT_OF slave_fpga_nstatus_gpio.external_connection
add_interface slave_fpga_conf_done_gpio_external_connection conduit end
set_interface_property slave_fpga_conf_done_gpio_external_connection EXPORT_OF slave_fpga_conf_done_gpio.external_connection
add_interface slave_fpga_nconfig_gpio_external_connection conduit end
set_interface_property slave_fpga_nconfig_gpio_external_connection EXPORT_OF slave_fpga_nconfig_gpio.external_connection
add_interface slave_fpga_nce_gpio_external_connection conduit end
set_interface_property slave_fpga_nce_gpio_external_connection EXPORT_OF slave_fpga_nce_gpio.external_connection
add_interface adc_conduit conduit end
set_interface_property adc_conduit EXPORT_OF adc_if_0.adc_conduit

save_system linuxsys.qsys
